# Altium schematic sheet ZYNQ_MIOBank_501.SchDoc
size A4; DocumentNumber: 9; SheetNumber: 9; SheetTotal: 47
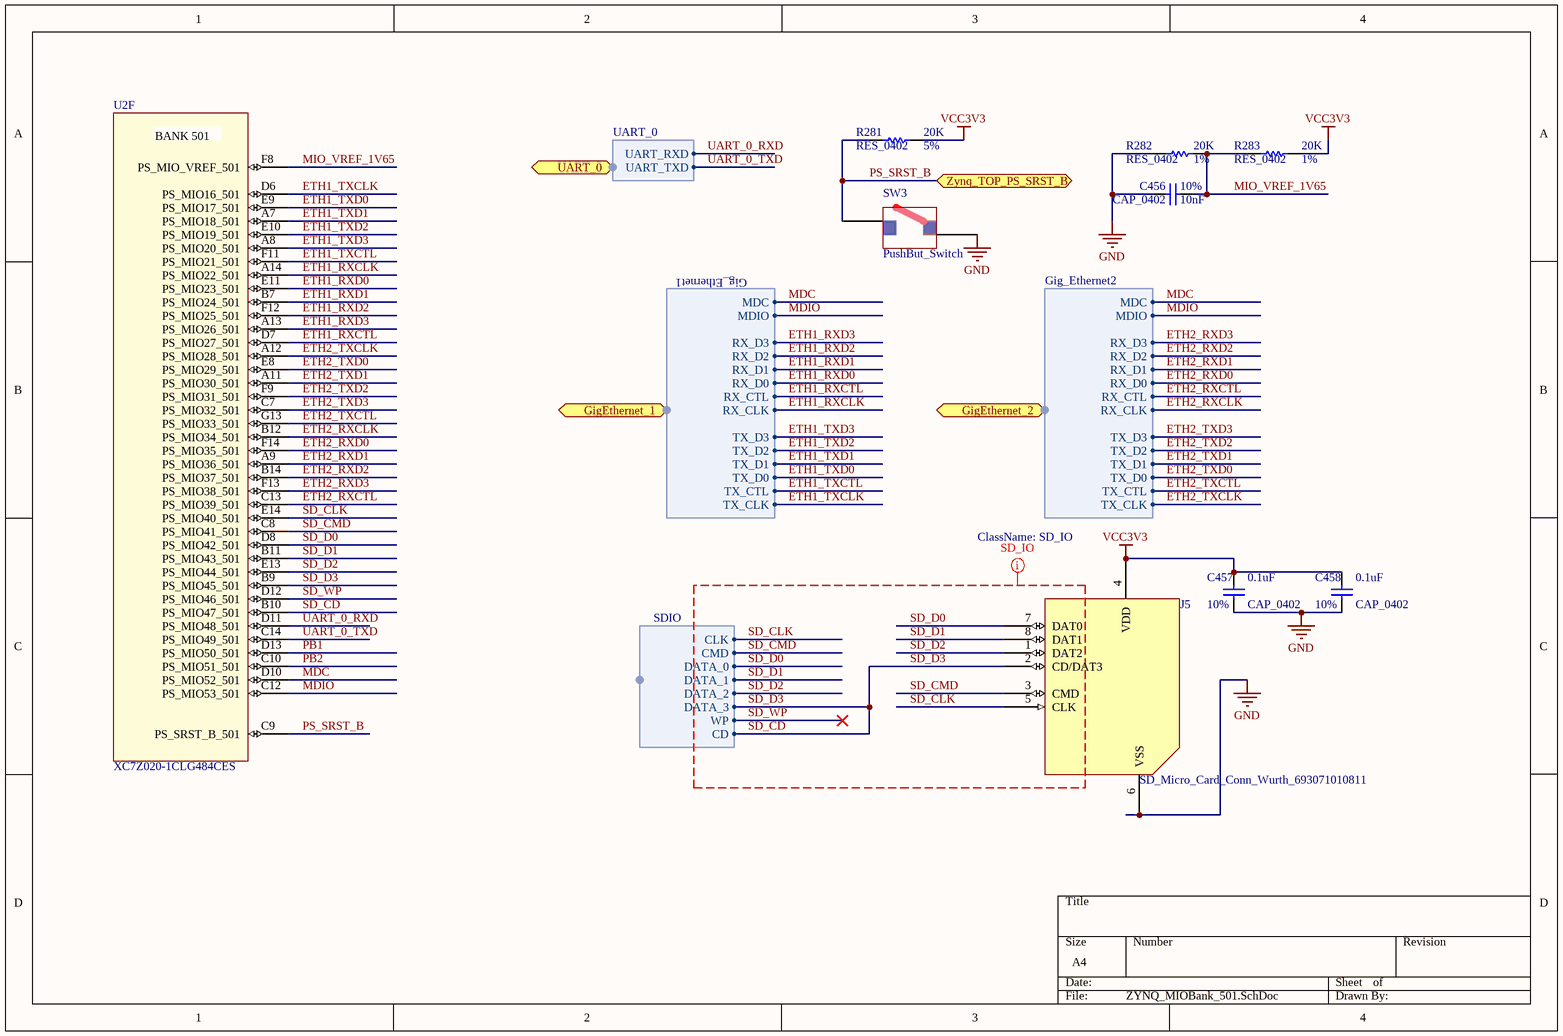
[diagram p0: ZYNQ_MIOBank_501.SchDoc]

## Parts
C456  CAP_0402  value 10nF  Tolerance: 10%  [CAPC0402(1005)60_N]
C457  CAP_0402  value 0.1uF  Tolerance: 10%  [CAPC0402(1005)60_N]
C458  CAP_0402  value 0.1uF  Tolerance: 10%  [CAPC0402(1005)60_N]
J5  SD_Micro_Card_Conn_Wurth_693071010811  [SD_Micro_Card_Conn_Wurth_693071010811]
R281  RES_0402  value 20K  Tolerance: 5%  [RESC0402(1005)_N]
R282  RES_0402  value 20K  Tolerance: 1%  [RESC0402(1005)_N]
R283  RES_0402  value 20K  Tolerance: 1%  [RESC0402(1005)_N]
SW3  PushBut_Switch  [PushButtonSwitch_CnK_1.14002.1110000]
U2  XC7Z020-1CLG484CES  [ZYNQ_xc7z020clg484pkg_BGA-484]  (part F of 10)

## Ports
GigEthernet_1 (harness Gig_Ethernet1), GigEthernet_2 (harness Gig_Ethernet2), UART_0 (harness UART_0), Zynq_TOP_PS_SRST_B (bidir)

## Harnesses
UART_0: UART_TXD, UART_RXD
Gig_Ethernet1: TX_CLK, TX_CTL, TX_D0, TX_D1, TX_D2, TX_D3, RX_D0, RX_D1, RX_D2, RX_D3, RX_CLK, RX_CTL, MDIO, MDC
Gig_Ethernet2: TX_CLK, TX_CTL, TX_D0, TX_D1, TX_D2, TX_D3, RX_D0, RX_D1, RX_D2, RX_D3, RX_CLK, RX_CTL, MDIO, MDC
SDIO: CLK, CMD, DATA_0, DATA_1, DATA_2, DATA_3, WP, CD

## Nets
GND: C456.2 C457.2 C458.2 J5.6(VSS) R282.1 SW3.4
VCC3V3: C457.1 C458.1 J5.4(VDD) R281.2 R283.2
ETH1_RXCLK: U2.A14(PS_MIO22_501) ; port GigEthernet_1.RX_CLK
ETH1_RXCTL: U2.D7(PS_MIO27_501) ; port GigEthernet_1.RX_CTL
ETH1_RXD0: U2.E11(PS_MIO23_501) ; port GigEthernet_1.RX_D0
ETH1_RXD1: U2.B7(PS_MIO24_501) ; port GigEthernet_1.RX_D1
ETH1_RXD2: U2.F12(PS_MIO25_501) ; port GigEthernet_1.RX_D2
ETH1_RXD3: U2.A13(PS_MIO26_501) ; port GigEthernet_1.RX_D3
ETH1_TXCLK: U2.D6(PS_MIO16_501) ; port GigEthernet_1.TX_CLK
ETH1_TXCTL: U2.F11(PS_MIO21_501) ; port GigEthernet_1.TX_CTL
ETH1_TXD0: U2.E9(PS_MIO17_501) ; port GigEthernet_1.TX_D0
ETH1_TXD1: U2.A7(PS_MIO18_501) ; port GigEthernet_1.TX_D1
ETH1_TXD2: U2.E10(PS_MIO19_501) ; port GigEthernet_1.TX_D2
ETH1_TXD3: U2.A8(PS_MIO20_501) ; port GigEthernet_1.TX_D3
ETH2_RXCLK: U2.B12(PS_MIO34_501) ; port GigEthernet_2.RX_CLK
ETH2_RXCTL: U2.C13(PS_MIO39_501) ; port GigEthernet_2.RX_CTL
ETH2_RXD0: U2.F14(PS_MIO35_501) ; port GigEthernet_2.RX_D0
ETH2_RXD1: U2.A9(PS_MIO36_501) ; port GigEthernet_2.RX_D1
ETH2_RXD2: U2.B14(PS_MIO37_501) ; port GigEthernet_2.RX_D2
ETH2_RXD3: U2.F13(PS_MIO38_501) ; port GigEthernet_2.RX_D3
ETH2_TXCLK: U2.A12(PS_MIO28_501) ; port GigEthernet_2.TX_CLK
ETH2_TXCTL: U2.G13(PS_MIO33_501) ; port GigEthernet_2.TX_CTL
ETH2_TXD0: U2.E8(PS_MIO29_501) ; port GigEthernet_2.TX_D0
ETH2_TXD1: U2.A11(PS_MIO30_501) ; port GigEthernet_2.TX_D1
ETH2_TXD2: U2.F9(PS_MIO31_501) ; port GigEthernet_2.TX_D2
ETH2_TXD3: U2.C7(PS_MIO32_501) ; port GigEthernet_2.TX_D3
MDC: U2.D10(PS_MIO52_501) ; port GigEthernet_1.MDC, port GigEthernet_2.MDC
MDIO: U2.C12(PS_MIO53_501) ; port GigEthernet_1.MDIO, port GigEthernet_2.MDIO
MIO_VREF_1V65: C456.1 R282.2 R283.1 U2.F8(PS_MIO_VREF_501)
PB1: U2.D13(PS_MIO50_501)
PB2: U2.C10(PS_MIO51_501)
PS_SRST_B: R281.1 SW3.3 U2.C9(PS_SRST_B_501) ; port Zynq_TOP_PS_SRST_B
SD_CD: J5.2(CD/DAT3) U2.B9(PS_MIO45_501) U2.B10(PS_MIO47_501) ; harness SDIO.DATA_3, harness SDIO.CD  [also labelled SD_D3]
SD_CLK: J5.5(CLK) U2.E14(PS_MIO40_501) ; harness SDIO.CLK
SD_CMD: J5.3(CMD) U2.C8(PS_MIO41_501) ; harness SDIO.CMD
SD_D0: J5.7(DAT0) U2.D8(PS_MIO42_501) ; harness SDIO.DATA_0
SD_D1: J5.8(DAT1) U2.B11(PS_MIO43_501) ; harness SDIO.DATA_1
SD_D2: J5.1(DAT2) U2.E13(PS_MIO44_501) ; harness SDIO.DATA_2
SD_WP: U2.D12(PS_MIO46_501) ; harness SDIO.WP
UART_0_RXD: U2.D11(PS_MIO48_501) ; port UART_0.UART_RXD
UART_0_TXD: U2.C14(PS_MIO49_501) ; port UART_0.UART_TXD

## Layout directives
net class SD_IO: SD_CD, SD_CLK, SD_CMD, SD_D0, SD_D1, SD_D2, SD_D3, SD_WP

## Notes on the sheet
- (in symbol XC7Z020-1CLG484CES, part F) BANK 501

## Library data of the parts
C456 = CAP_0402: 10000pF, ceramic, 10% 6.3V X5R, 0402; Part Number: GRM155R60J103KA01D; Manufacturer: Murata Electronics North America; Footprint Ref: CAPC0402(1005)60_N; Library Ref: CAP_0402
C457 C458 = CAP_0402: 0.1uf, ceramic, 10%, 6.3V, X5R, 0402; Part Number: C1005X5R0J104K; Manufacturer: TDK Corporation; Footprint Ref: CAPC0402(1005)60_N; Library Ref: CAP_0402
J5 = "693071010811": CONN MICRO SD 8 POS SMD; Manufacturer: Wurth Electronics Inc; Part Number: "693071010811"
R281 = RES_0402: 20K ohm, 5%, 1/16W, 0402; Part Number: ERJ-2GEJ203X; Manufacturer: Panasonic - ECG; Library Ref: RES_0402; Footprint Ref: RESC0402(1005)_N
R282 R283 = RES_0402: RES 20.0K OHM 1/10W 1% 0402 SMD; Part Number: ERJ-2RKF2002X; Manufacturer: Panasonic Electronic Components; Library Ref: RES_0402; Footprint Ref: RESC0402(1005)_N
SW3 = 1.14002.1110000: SWITCH PUSH SPST-NO 0.1A 35V; Manufacturer: C&K Components; Part Number: 1.14002.1110000
U2 = XC7Z020-1CLG484CES: XC7Z020-1CLG484CES, Zynq-7000 All Programmable SoC; Manufacturer: Xilinx; Part Number: XC7Z020-1CLG484CES